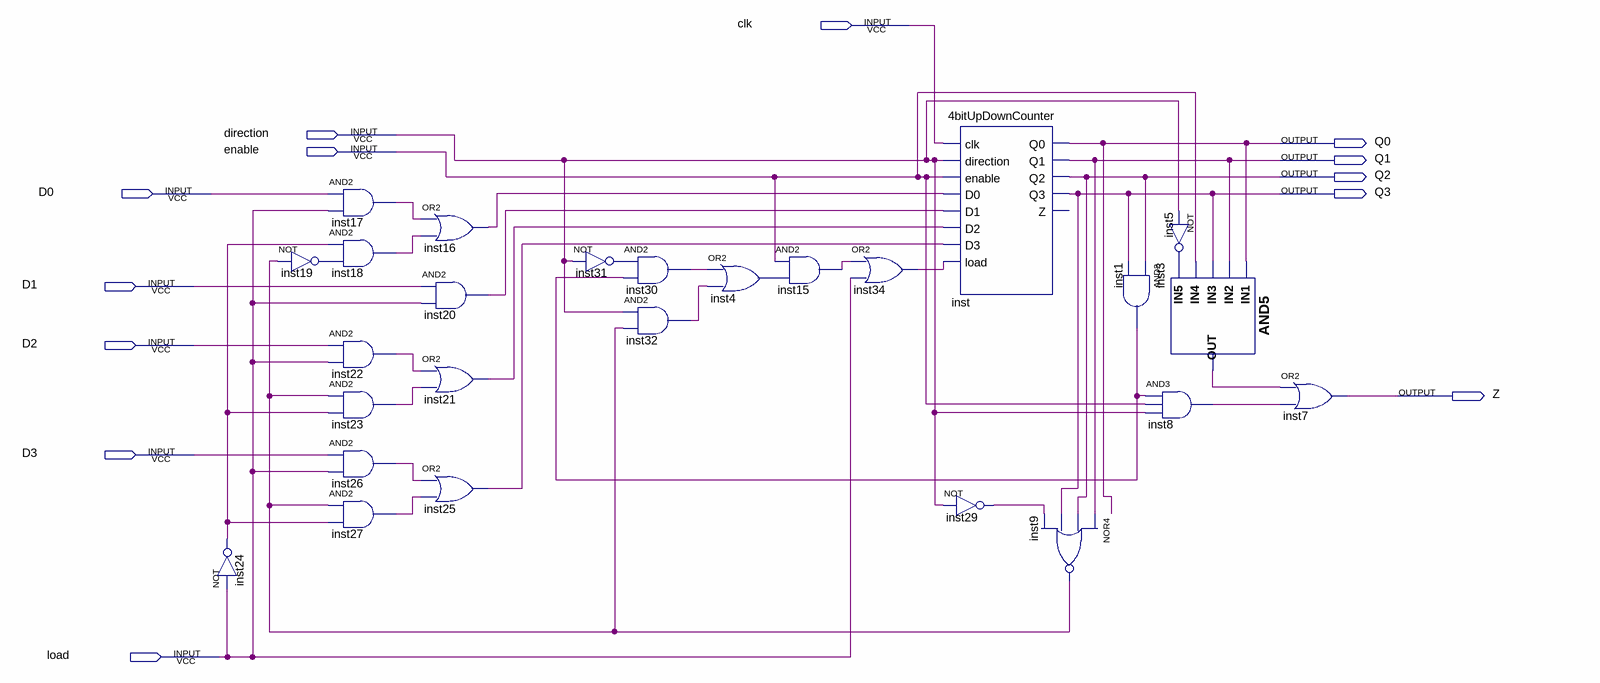
[diagram p0: schematic sheet]
// Quartus schematic counterHr.bdf as structural Verilog: 26 symbols, 13 pins
module counterHr (
  input  clk,
  input  direction,
  input  enable,
  input  D0,
  input  D1,
  input  D2,
  input  D3,
  input  load,
  output Q0,
  output Q1,
  output Q2,
  output Q3,
  output Z
);

  wire inst1_out, inst3_out, inst4_out, inst5_out, inst8_out, inst9_out, inst15_out, inst16_out, inst17_out,
       inst18_out, inst19_out, inst20_out, inst21_out, inst22_out, inst23_out, inst24_out, inst25_out,
       inst26_out, inst27_out, inst29_out, inst30_out, inst31_out, inst32_out, inst34_out;

  not inst24 (inst24_out, load);
  and inst17 (inst17_out, D0, load);
  and inst18 (inst18_out, inst24_out, inst19_out);
  not inst19 (inst19_out, inst9_out);
  and inst22 (inst22_out, D2, load);
  and inst23 (inst23_out, inst9_out, inst24_out);
  and inst26 (inst26_out, D3, load);
  and inst27 (inst27_out, inst9_out, inst24_out);
  or inst16 (inst16_out, inst17_out, inst18_out);
  and inst20 (inst20_out, D1, load);
  or inst21 (inst21_out, inst22_out, inst23_out);
  or inst25 (inst25_out, inst26_out, inst27_out);
  not inst31 (inst31_out, direction);
  and inst30 (inst30_out, inst31_out, inst1_out);
  and inst32 (inst32_out, direction, inst9_out);
  or inst4 (inst4_out, inst30_out, inst32_out);
  and inst15 (inst15_out, enable, inst4_out);
  or inst34 (inst34_out, inst15_out, load);
  \4bitUpDownCounter  inst (
    .clk(clk), .direction(direction), .enable(enable), .D0(inst16_out), .D1(inst20_out), .D2(inst21_out),
    .D3(inst25_out), .load(inst34_out), .Q0(Q0), .Q1(Q1), .Q2(Q2), .Q3(Q3));  // open: Z
  not inst29 (inst29_out, direction);
  nor inst9 (inst9_out, Q1, Q2, Q3, inst29_out);
  and inst1 (inst1_out, Q2, Q3);
  and inst8 (inst8_out, inst1_out, enable, direction);
  not inst5 (inst5_out, direction);
  and inst3 (inst3_out, Q0, Q1, Q3, enable, inst5_out);
  or inst7 (Z, inst3_out, inst8_out);
endmodule
